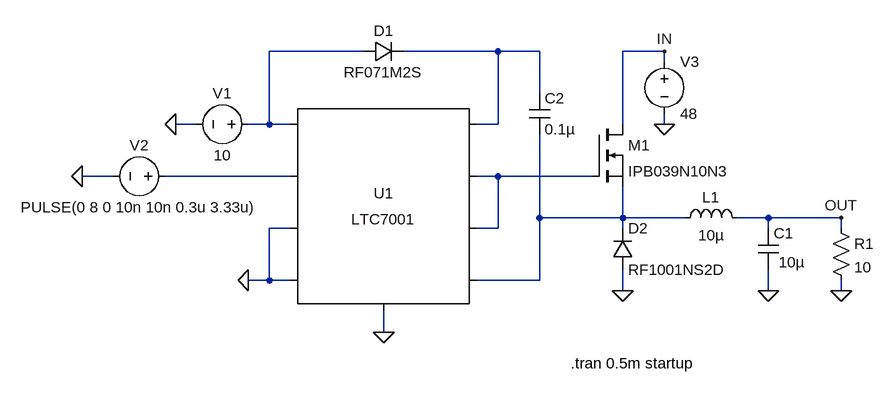
[diagram p0: schematic 7001.asc]
7001.asc, the LTspice schematic file:
Version 4
SHEET 1 2336 1256
WIRE 1120 -288 976 -288
WIRE 1328 -288 1184 -288
WIRE 1392 -288 1328 -288
WIRE 1584 -288 1520 -288
WIRE 1584 -272 1584 -288
WIRE 1392 -224 1392 -288
WIRE 864 -176 832 -176
WIRE 976 -176 976 -288
WIRE 976 -176 944 -176
WIRE 1008 -176 976 -176
WIRE 1328 -176 1328 -288
WIRE 1328 -176 1296 -176
WIRE 1520 -176 1520 -288
WIRE 1584 -176 1584 -192
WIRE 736 -96 688 -96
WIRE 1008 -96 816 -96
WIRE 1328 -96 1296 -96
WIRE 1472 -96 1328 -96
WIRE 1392 -32 1392 -160
WIRE 1520 -32 1520 -80
WIRE 1520 -32 1392 -32
WIRE 1616 -32 1520 -32
WIRE 1744 -32 1696 -32
WIRE 1856 -32 1744 -32
WIRE 1008 -16 976 -16
WIRE 1328 -16 1328 -96
WIRE 1328 -16 1296 -16
WIRE 1520 -16 1520 -32
WIRE 1744 -16 1744 -32
WIRE 1856 -16 1856 -32
WIRE 976 64 976 -16
WIRE 976 64 944 64
WIRE 1008 64 976 64
WIRE 1392 64 1392 -32
WIRE 1392 64 1296 64
WIRE 1520 80 1520 48
WIRE 1744 80 1744 48
WIRE 1856 80 1856 64
WIRE 1152 144 1152 112
FLAG 944 64 0
FLAG 832 -176 0
FLAG 688 -96 0
FLAG 1584 -176 0
FLAG 1744 80 0
FLAG 1856 80 0
FLAG 1856 -32 OUT
FLAG 1520 80 0
FLAG 1152 144 0
FLAG 1584 -288 IN
SYMBOL voltage 960 -176 R90
WINDOW 0 -32 56 VBottom 2
WINDOW 3 32 56 VTop 2
SYMATTR InstName V1
SYMATTR Value 10
SYMBOL voltage 832 -96 R90
WINDOW 123 74 56 VTop 2
WINDOW 39 53 56 VTop 2
WINDOW 0 -32 56 VBottom 2
WINDOW 3 32 56 VTop 2
SYMATTR InstName V2
SYMATTR Value PULSE(0 8 0 10n 10n 0.3u 3.33u)
SYMBOL diode 1120 -272 R270
WINDOW 0 32 32 VTop 2
WINDOW 3 0 32 VBottom 2
SYMATTR InstName D1
SYMATTR Value RF071M2S
SYMBOL nmos 1472 -176 R0
SYMATTR InstName M1
SYMATTR Value IPB039N10N3
SYMBOL ind 1600 -16 R270
WINDOW 0 32 56 VTop 2
WINDOW 3 5 56 VBottom 2
SYMATTR InstName L1
SYMATTR Value 10µ
SYMATTR SpiceLine Rser=3m
SYMBOL cap 1728 -16 R0
WINDOW 3 32 52 Left 2
SYMATTR Value 10µ
SYMATTR SpiceLine Rser=7m
SYMATTR InstName C1
SYMBOL res 1840 -32 R0
SYMATTR InstName R1
SYMATTR Value 10
SYMBOL voltage 1584 -288 R0
SYMATTR InstName V3
SYMATTR Value 48
SYMBOL cap 1376 -224 R0
SYMATTR InstName C2
SYMATTR Value 0.1µ
SYMBOL diode 1504 48 M180
WINDOW 0 24 64 Left 2
WINDOW 3 24 0 Left 2
SYMATTR InstName D2
SYMATTR Value RF1001NS2D
SYMBOL LTC7001 1152 -48 R0
SYMATTR InstName U1
TEXT 1440 192 Left 2 !.tran 0.5m startup

The netlist it stands for:
* 7001.asc
V1 N001 0 10
V2 N003 0 PULSE(0 8 0 10n 10n 0.3u 3.33u)
D1 N001 N002 RF071M2S
M1 IN N004 N005 N005 IPB039N10N3
L1 N005 OUT 10µ Rser=3m
C1 OUT 0 10µ Rser=7m
R1 OUT 0 10
V3 IN 0 48
C2 N002 N005 0.1µ
D2 0 N005 RF1001NS2D
XU1 N001 0 0 N003 0 N004 N004 N005 N002 LTC7001
.model D D
.lib standard.dio
.model NMOS NMOS
.model PMOS PMOS
.lib standard.mos
.tran 0.5m startup
.lib LTC7001.sub
.backanno
.end